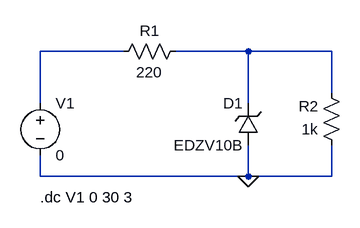
[diagram p0: schematic 7.Zener Voltage Regulator.asc]
7.Zener Voltage Regulator.asc, the LTspice schematic file:
Version 4
SHEET 1 880 680
WIRE 128 112 0 112
WIRE 320 112 208 112
WIRE 448 112 320 112
WIRE 448 176 448 112
WIRE 0 192 0 112
WIRE 320 192 320 112
WIRE 0 304 0 272
WIRE 320 304 320 256
WIRE 320 304 0 304
WIRE 448 304 448 256
WIRE 448 304 320 304
FLAG 320 304 0
SYMBOL res 224 96 R90
WINDOW 0 0 56 VBottom 2
WINDOW 3 32 56 VTop 2
SYMATTR InstName R1
SYMATTR Value 220
SYMBOL res 464 272 R180
WINDOW 0 36 76 Left 2
WINDOW 3 36 40 Left 2
SYMATTR InstName R2
SYMATTR Value 1k
SYMBOL zener 336 256 R180
WINDOW 0 24 64 Left 2
WINDOW 3 24 0 Left 2
SYMATTR InstName D1
SYMATTR Value EDZV10B
SYMATTR Description Diode
SYMATTR Type diode
SYMBOL voltage 0 176 R0
WINDOW 123 0 0 Left 0
WINDOW 39 0 0 Left 0
SYMATTR InstName V1
SYMATTR Value 0
TEXT 0 336 Left 2 !.dc V1 0 30 3

The netlist it stands for:
* 7.Zener Voltage Regulator.asc
R1 N002 N001 220
R2 0 N002 1k
D1 0 N002 EDZV10B
V1 N001 0 0
.model D D
.lib standard.dio
.dc V1 0 30 3
.backanno
.end